# EAGLE design VIC20_HypExp (EAGLE 9.5.2)
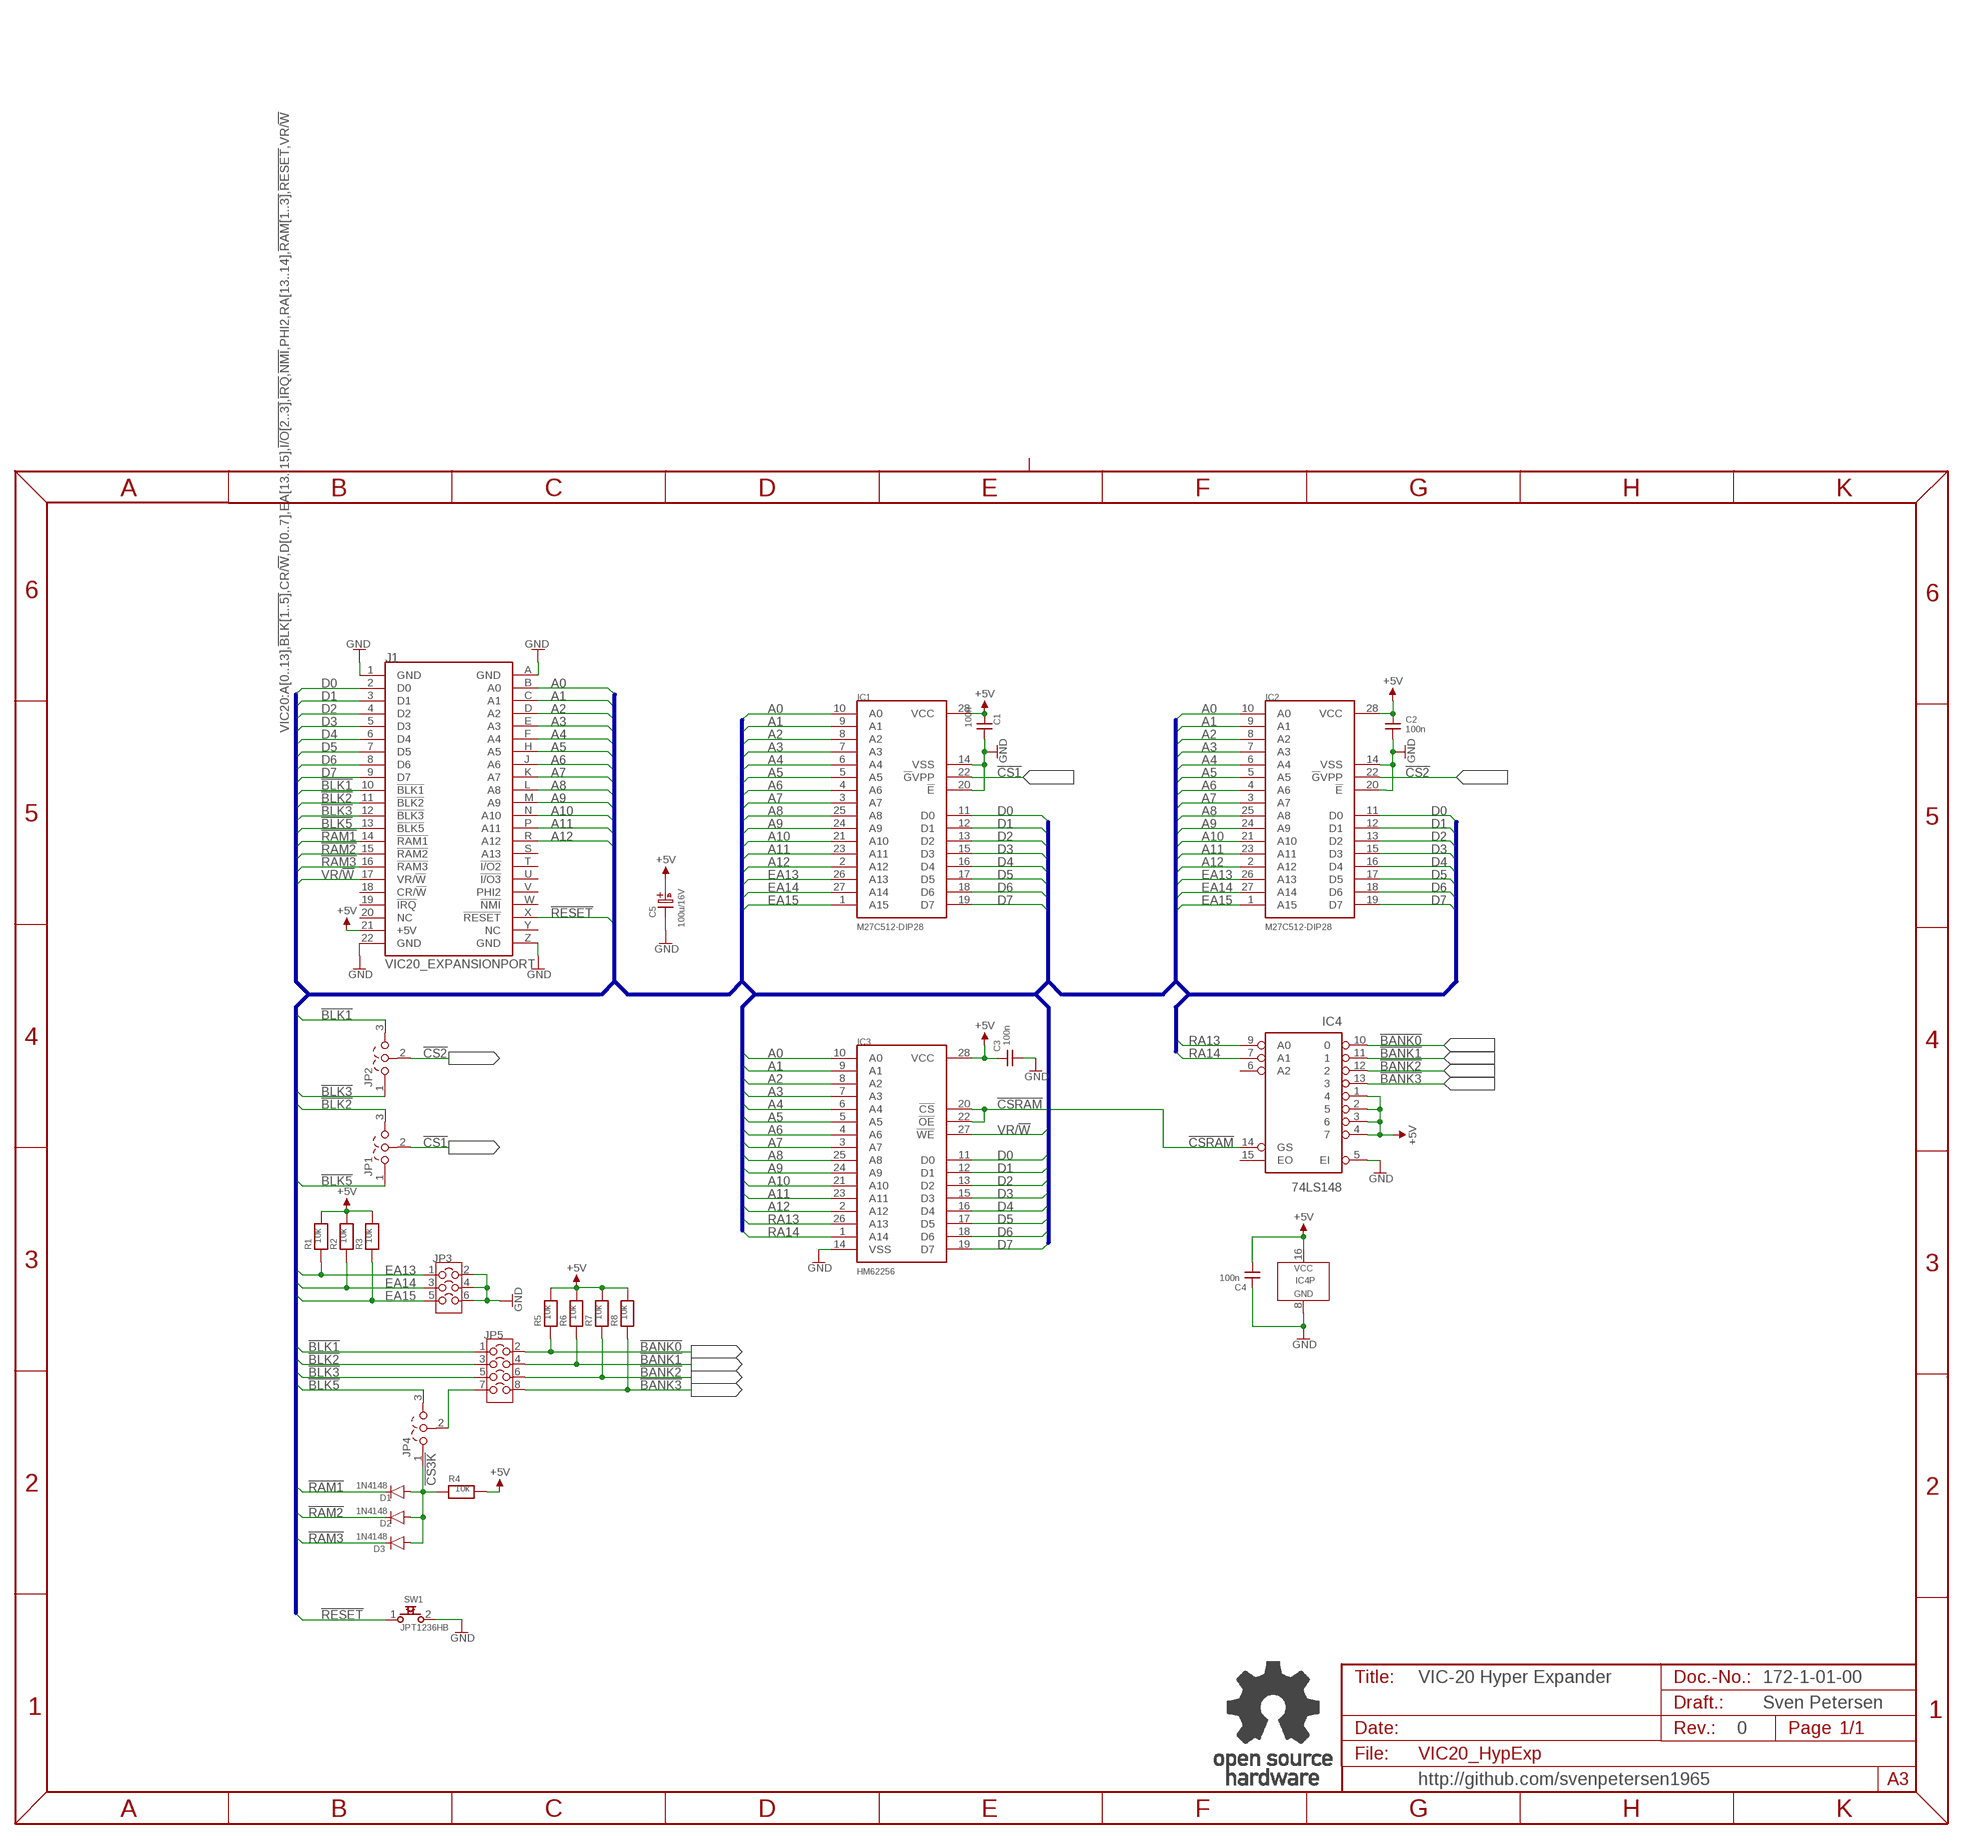
[diagram p0: schematic, sheet 1]

## Parts
C1  100n  CAP01  [C-2,5]
C2  100n  CAP01  [C-2,5]
C3  100n  CAP01  [C-2,5]
C4  100n  CAP01  [C-2,5]
C5  100u/16V  C07/2,5  [C07/2,5]
D1  1N4148  1N41480.3"  [DO-35/3]
D2  1N4148  1N41480.3"  [DO-35/3]
D3  1N4148  1N41480.3"  [DO-35/3]
IC1  M27C512-DIP28  [DIL28-6]
IC2  M27C512-DIP28  [DIL28-6]
IC3  HM62256  [DIL28-6]
IC4  74LS148  74148DIL  [DIL-16]
J1  VIC20_EXPANSIONPORT  [VIC20_EXPANSION]
JP1  COMBI-3P  [COMBI-3P]
JP2  COMBI-3P  [COMBI-3P]
JP3  COMBI-3X2P  [COMBI-3X2]
JP4  COMBI-3P  [COMBI-3P]
JP5  COMBI-4X2P  [COMBI-4X2]
R1  10k  RES04  [R-10]
R2  10k  RES04  [R-10]
R3  10k  RES04  [R-10]
R4  10k  RES04  [R-10]
R5  10k  RES04  [R-10]
R6  10k  RES04  [R-10]
R7  10k  RES04  [R-10]
R8  10k  RES04  [R-10]
SW1  JPT1236HB  [JTP_1236HB]
U$2  OPEN_SOURCE_HW  [OPENHW]

## Nets
!BANK0: IC4.10 JP5.2 R5.1
!BANK1: IC4.11 JP5.4 R6.1
!BANK2: IC4.12 JP5.6 R7.1
!BANK3: IC4.13 JP5.8 R8.1
!BLK1: J1.10(!BLK1) JP2.3 JP5.1
!BLK2: J1.11(!BLK2) JP1.3 JP5.3
!BLK3: J1.12(!BLK3) JP2.1 JP5.5
!BLK5: J1.13(!BLK5) JP1.1 JP4.3
!CS1: IC1.22(!G!VPP) JP1.2
!CS2: IC2.22(!G!VPP) JP2.2
!CS3K: D1.A D2.A D3.A JP4.1 R4.1
!CSRAM: IC3.20(!CS) IC3.22(!OE) IC4.14(GS)
!RAM1: D1.K J1.14(!RAM1)
!RAM2: D2.K J1.15(!RAM2)
!RAM3: D3.K J1.16(!RAM3)
!RESET: J1.X(!RESET) SW1.1
+5V: C1.1 C2.1 C3.2 C4.1 C5.A(+) IC1.28(VCC) IC2.28(VCC) IC3.28(VCC) IC4.1 IC4.2 IC4.3 IC4.4 IC4.16(VCC) J1.21(+5V) R1.2 R2.2 R3.2 R4.2 R5.2 R6.2 R7.2 R8.2
A0: IC1.10(A0) IC2.10(A0) IC3.10(A0) J1.B(A0)
A1: IC1.9(A1) IC2.9(A1) IC3.9(A1) J1.C(A1)
A2: IC1.8(A2) IC2.8(A2) IC3.8(A2) J1.D(A2)
A3: IC1.7(A3) IC2.7(A3) IC3.7(A3) J1.E(A3)
A4: IC1.6(A4) IC2.6(A4) IC3.6(A4) J1.F(A4)
A5: IC1.5(A5) IC2.5(A5) IC3.5(A5) J1.H(A5)
A6: IC1.4(A6) IC2.4(A6) IC3.4(A6) J1.J(A6)
A7: IC1.3(A7) IC2.3(A7) IC3.3(A7) J1.K(A7)
A8: IC1.25(A8) IC2.25(A8) IC3.25(A8) J1.L(A8)
A9: IC1.24(A9) IC2.24(A9) IC3.24(A9) J1.M(A9)
A10: IC1.21(A10) IC2.21(A10) IC3.21(A10) J1.N(A10)
A11: IC1.23(A11) IC2.23(A11) IC3.23(A11) J1.P(A11)
A12: IC1.2(A12) IC2.2(A12) IC3.2(A12) J1.R(A12)
D0: IC1.11(D0) IC2.11(D0) IC3.11(D0) J1.2(D0)
D1: IC1.12(D1) IC2.12(D1) IC3.12(D1) J1.3(D1)
D2: IC1.13(D2) IC2.13(D2) IC3.13(D2) J1.4(D2)
D3: IC1.15(D3) IC2.15(D3) IC3.15(D3) J1.5(D3)
D4: IC1.16(D4) IC2.16(D4) IC3.16(D4) J1.6(D4)
D5: IC1.17(D5) IC2.17(D5) IC3.17(D5) J1.7(D5)
D6: IC1.18(D6) IC2.18(D6) IC3.18(D6) J1.8(D6)
D7: IC1.19(D7) IC2.19(D7) IC3.19(D7) J1.9(D7)
EA13: IC1.26(A13) IC2.26(A13) JP3.1 R1.1
EA14: IC1.27(A14) IC2.27(A14) JP3.3 R2.1
EA15: IC1.1(A15) IC2.1(A15) JP3.5 R3.1
GND: C1.2 C2.2 C3.1 C4.2 C5.K(-) IC1.14(VSS) IC1.20(!E) IC2.14(VSS) IC2.20(!E) IC3.14(VSS) IC4.5(EI) IC4.8(GND) J1.1(GND) J1.22(GND) J1.A(GND) J1.Z(GND) JP3.2 JP3.4 JP3.6 SW1.2
N$1: JP4.2 JP5.7
RA13: IC3.26(A13) IC4.9(A0)
RA14: IC3.1(A14) IC4.7(A1)
VR/!W: IC3.27(!WE) J1.17(VR/!W)
Unconnected: IC4.6(A2) IC4.15(EO) J1.18(CR/!W) J1.19(!IRQ) J1.S(A13) J1.T(!I/O2) J1.U(!I/O3) J1.V(PHI2) J1.W(!NMI) J1.Y(NC)

## Buses
VIC20:A[0..13],!BLK[1..5],CR/!W,D[0..7],EA[13..15],!I/O[2..3],!IRQ,!NMI,PHI2,RA[13..14],!RAM[1..3],!RESET,VR/!W

## Notes on the sheet
- VIC-20 Hyper Expander | 172-1-01-00
- Sven Petersen
- 0
- http://github.com/svenpetersen1965

## Power pins joined to a net without a drawn wire
NC: J1.20(NC)

## Library data of the parts
C1-C4 = DISCRETE:CAP01
C5 = ELCO:C07/2,5
D1-D3 = Dioden:1N4148
IC1 IC2 = ST:M27C512
IC3 = Hitachi:HM62256
IC4 = 74XX:74148
J1 = Commodore:VIC20_EXPANSIONPORT
JP1 JP2 JP4 = Cutpad:COMBI-3P
JP3 = Cutpad:COMBI-3X2P
JP5 = Cutpad:COMBI-4X2P
R1-R8 = DISCRETE:RES04
SW1 = Namae_Electronics:JPT1236HB
U$2 = Logo:OPEN_SOURCE_HW

## Board
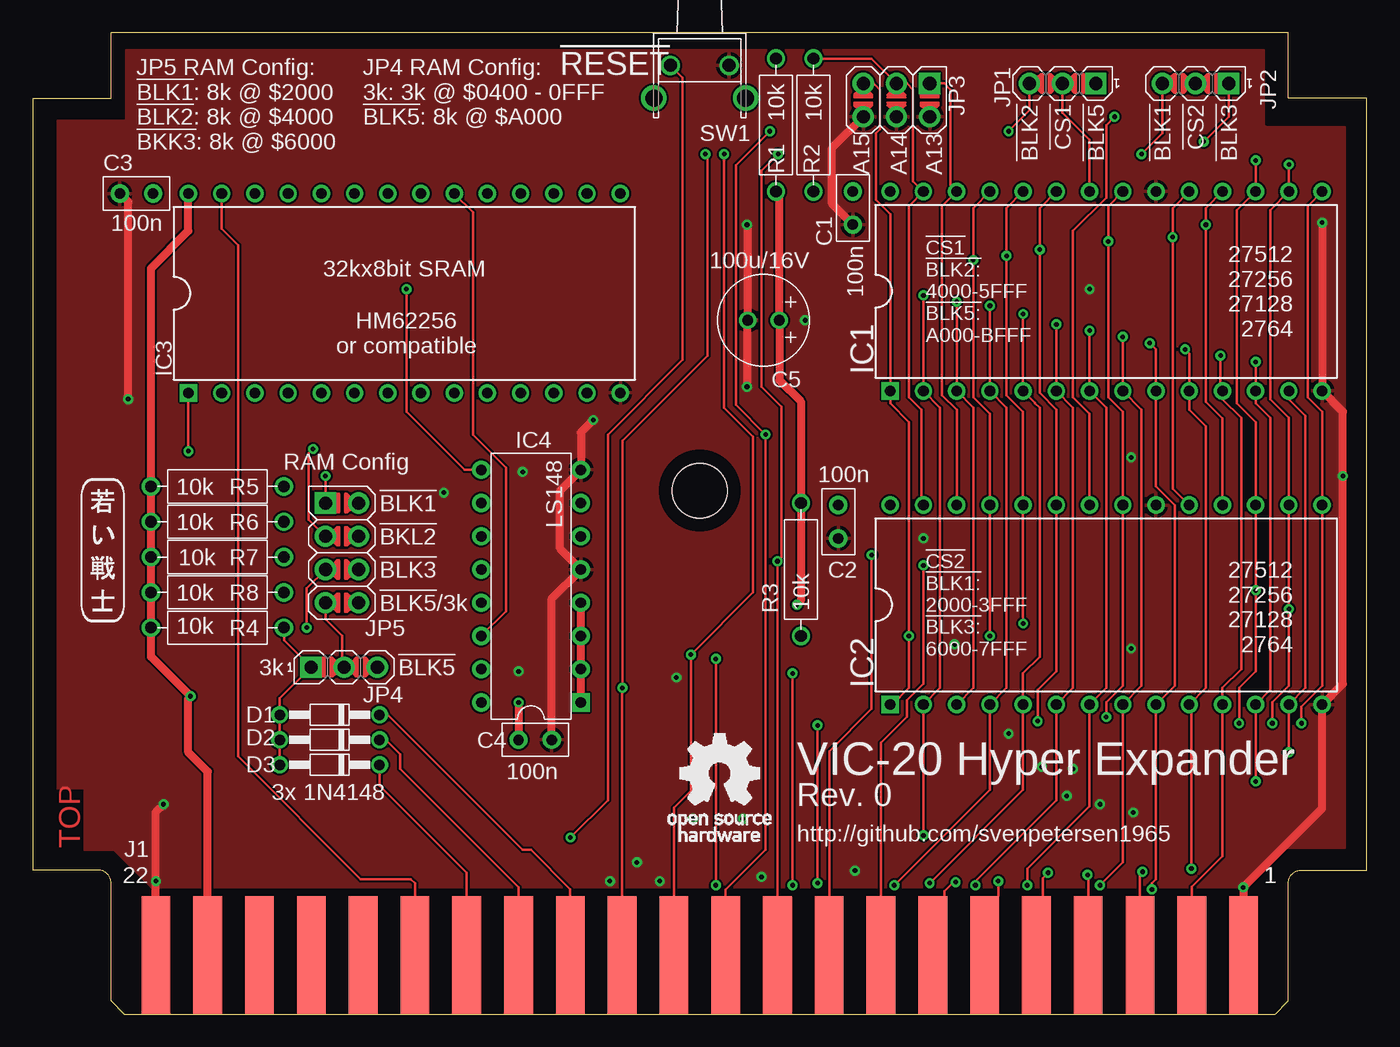
[diagram p1: board, top side]
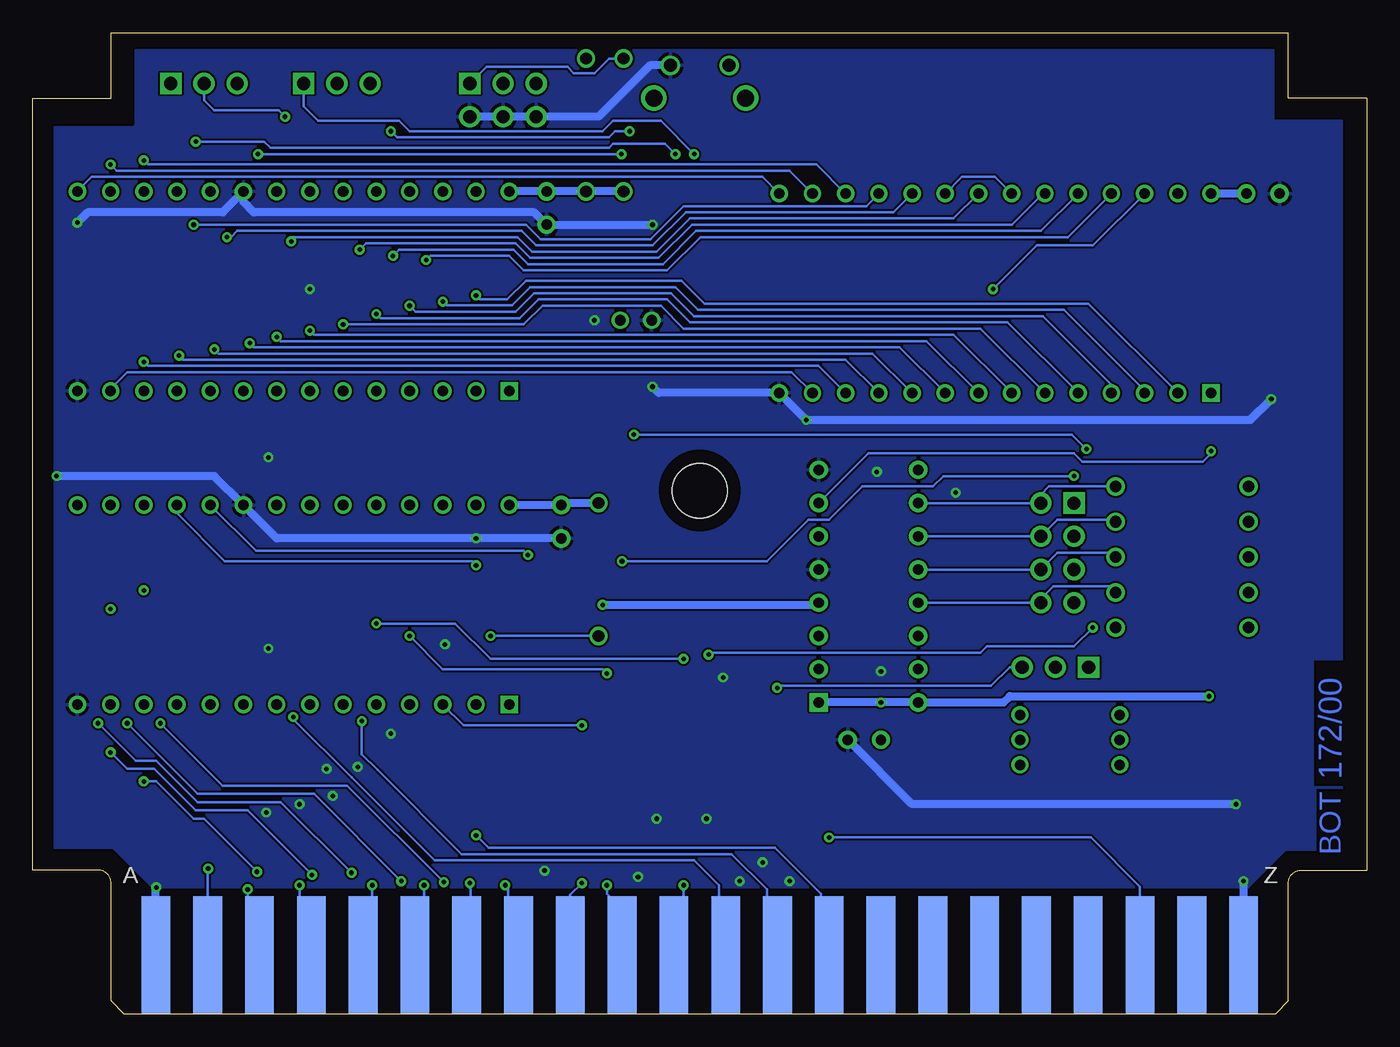
[diagram p2: board, bottom side, seen from below]

Size 102 x 75 mm. Coordinates in mm from the lower left corner, seen from the top.
Outline: 102,11 102,70 96,70 96,75 6,75 6,70 0,70 0,11
Copper layers (1*16): Top 0.035mm / dielectric 1.5mm / Bottom 0.035mm
Design rules "default *": minimum track width 6mil, minimum drill 0.35mm, track to track 6mil, track to pad 6mil, pad to pad 6mil, via to via 6mil, smd to smd 6mil, copper to edge 40mil, drill to drill 6mil, minimum pad ring 10mil, minimum via ring 8mil, stop-mask expansion 4mil, vias tented up to drill 23mil, thermal gap 10mil
Holes 4.2 mm at 51,40
bRestrict: 3 lines

### Footprints (pad centres in the part's own frame; a part is rotated, then mirrored left to right if it is on the bottom)
C-2,5 = drill 0.8 pad 1.397: 1 -1.27,0; 2 1.27,0
C07/2,5 = drill 0.813 pad 1.27: A -1.202,0; K 1.202,0
DO-35/3 = drill 0.8: A -3.81,0; K 3.81,0
DIL28-6 = drill 0.813 square: 1 -16.51,-7.62 | drill 0.813: 2 -13.97,-7.62; 3 -11.43,-7.62; 4 -8.89,-7.62; 5 -6.35,-7.62; 6 -3.81,-7.62; 7 -1.27,-7.62; 8 1.27,-7.62; 9 3.81,-7.62; 10 6.35,-7.62; 11 8.89,-7.62; 12 11.43,-7.62; 13 13.97,-7.62; 14 16.51,-7.62; 15 16.51,7.62; 16 13.97,7.62; 17 11.43,7.62; 18 8.89,7.62; 19 6.35,7.62; 20 3.81,7.62; 21 1.27,7.62; 22 -1.27,7.62; 23 -3.81,7.62; 24 -6.35,7.62; 25 -8.89,7.62; 26 -11.43,7.62; 27 -13.97,7.62; 28 -16.51,7.62
DIL-16 = drill 0.8 pad 1.397 square: 1 -8.89,-3.81 | drill 0.8 pad 1.397: 2 -6.35,-3.81; 3 -3.81,-3.81; 4 -1.27,-3.81; 5 1.27,-3.81; 6 3.81,-3.81; 7 6.35,-3.81; 8 8.89,-3.81; 9 8.89,3.81; 10 6.35,3.81; 11 3.81,3.81; 12 1.27,3.81; 13 -1.27,3.81; 14 -3.81,3.81; 15 -6.35,3.81; 16 -8.89,3.81
VIC20_EXPANSION = smd 2.2 x 9: 1 41.58,4.5; 2 37.62,4.5; 3 33.66,4.5; 4 29.7,4.5; 5 25.74,4.5; 6 21.78,4.5; 7 17.82,4.5; 8 13.86,4.5; 9 9.9,4.5; 10 5.94,4.5; 11 1.98,4.5; 12 -1.98,4.5; 13 -5.94,4.5; 14 -9.9,4.5; 15 -13.86,4.5; 16 -17.82,4.5; 17 -21.78,4.5; 18 -25.74,4.5; 19 -29.7,4.5; 20 -33.66,4.5; 21 -37.62,4.5; 22 -41.58,4.5 | smd 2.2 x 9 bottom: A 41.58,4.5; B 37.62,4.5; C 33.66,4.5; D 29.7,4.5; E 25.74,4.5; F 21.78,4.5; H 17.82,4.5; J 13.86,4.5; K 9.9,4.5; L 5.94,4.5; M 1.98,4.5; N -1.98,4.5; P -5.94,4.5; R -9.9,4.5; S -13.86,4.5; T -17.82,4.5; U -21.78,4.5; V -25.74,4.5; W -29.7,4.5; X -33.66,4.5; Y -37.62,4.5; Z -41.58,4.5
COMBI-3P = drill 1 pad 1.626 square: 1 -2.54,0 | drill 1 pad 1.626: 2 0,0; 3 2.54,0
COMBI-3X2 = drill 1 pad 1.626 square: 1 -1.27,2.54 | drill 1 pad 1.626: 2 1.27,2.54; 3 -1.27,0; 4 1.27,0; 5 -1.27,-2.54; 6 1.27,-2.54
COMBI-4X2 = drill 1 pad 1.626 square: 1 -1.27,3.81 | drill 1 pad 1.626: 2 1.27,3.81; 3 -1.27,1.27; 4 1.27,1.27; 5 -1.27,-1.27; 6 1.27,-1.27; 7 -1.27,-3.81; 8 1.27,-3.81
R-10 = drill 0.889 pad 1.397: 1 -5.08,0; 2 5.08,0
JTP_1236HB = drill 1: 1 2.25,0; 2 -2.25,0 | drill 1.3: CS1 3.5,2.5; CS2 -3.5,2.5

### Placement (x,y rotation side)
C1  62.71,61.59 270 top
C2  61.59,37.62 270 top
C3  7.94,62.71 0 top
C4  38.42,20.95 0 top
C5  55.88,53.02 180 top
D1  22.7,22.86 0 top
D2  22.7,20.95 0 top
D3  22.7,19.05 0 top
IC1  82.07,55.24 0 top
IC2  82.07,31.27 0 top
IC3  28.42,55.09 0 top
IC4  38.1,32.7 90 top
J1  51,0 0 top
JP1  78.74,71.12 180 top
JP2  88.9,71.12 180 top
JP3  66.04,69.85 270 top
JP4  23.81,26.51 0 top
JP5  23.65,35.24 0 top
R1  56.83,67.94 270 top
R2  59.69,67.94 270 top
R3  58.74,33.97 90 top
R4  14.13,29.53 180 top
R5  14.13,40.32 180 top
R6  14.13,37.62 180 top
R7  14.13,34.92 180 top
R8  14.13,32.23 180 top
SW1  51,72.5 180 top
U$2  48.58,13.18 0 top
U$15  [SVEN_TAG]  5.4,35.56 0 top
U$16  [2LAYER]  3.65,12.7 90 top
U$40  [PCB-TITLE/]  0,87 0 top  (outside the outline)

### Tracks (layer width: path | path; a pad name or v marks a point on that pad's centre or on a via)
!BANK0
  Bottom 0.203: IC4.10 JP5.2 24.92,39.69 24.29,40.32 R5.1
!BANK1
  Bottom 0.203: IC4.11 JP5.4 23.65,37.78 19.37,37.78 R6.1
!BANK2
  Bottom 0.203: IC4.12 JP5.6 23.65,35.24 19.53,35.24 R7.1
!BANK3
  Bottom 0.203: IC4.13 JP5.8 24.92,31.75 23.97,32.7 19.68,32.7 R8.1
!BLK1  (via drill 0.35)
  Top 0.203: J1.10 v56.94,34.61 57.26,34.92 57.26,46.41 55.72,47.94 55.72,64.45 v56.99,65.72 | v84.77,65.72 86.36,67.31 JP2.3 | JP5.1 v22.38,41.12
  Bottom 0.203: v56.99,65.72 v84.77,65.72 | v22.38,41.12 32.38,41.12 33.18,40.32 38.58,40.32 41.12,37.78 42.7,37.78 45.88,34.61 v56.94,34.61
!BLK2  (via drill 0.35)
  Top 0.203: J1.11 52.98,9.48 56.04,12.54 v56.04,44.29 53.76,46.57 53.76,64.88 v56.36,67.47 | v74.61,67.47 76.2,69.06 JP1.3 | JP5.3 21.11,37.78 21.11,42.86 v21.43,43.18
  Bottom 0.203: v56.36,67.47 57.47,67.47 57.94,66.99 74.14,66.99 v74.61,67.47 | v21.43,43.18 22.54,44.29 v56.04,44.29
!BLK3  (via drill 0.35)
  Top 0.203: J1.12 49.02,15.75 50.32,17.05 v50.32,27.46 55.09,32.23 55.09,44.13 52.86,46.35 v52.86,65.72 | v89.53,66.67 91.44,68.58 JP2.1 | JP5.5 20.95,32.54 v20.95,29.53
  Bottom 0.203: v52.86,65.72 53.66,66.52 57.63,66.52 57.94,66.2 83.82,66.2 84.3,66.67 v89.53,66.67 | v20.95,29.53 22.38,28.1 29.05,28.1 29.53,27.62 50.16,27.62 v50.32,27.46
!BLK5  (via drill 0.35)
  Top 0.203: v51.44,65.72 51.59,65.56 51.59,50.32 45.09,43.81 v45.09,24.92 45.06,24.9 J1.13
  Bottom 0.203: v51.44,65.72 53.98,68.26 57.63,68.26 58.42,67.47 73.18,67.47 73.98,68.26 80.17,68.26 81.28,69.37 JP1.1 | v45.09,24.92 44.93,25.08 28.73,25.08 27.3,26.51 JP4.3
!CS1
  Top 0.203: IC1.22 80.8,66.83 78.74,68.9 JP1.2
!CS2  (via drill 0.35)
  Top 0.203: IC2.22 80.8,45.88 79.53,47.15 79.53,59.85 82.07,62.39 82.07,67.94 v82.71,68.58
  Bottom 0.203: v82.71,68.58 83.19,69.06 88.11,69.06 88.9,69.85 JP2.2
!CS3K
  Top 0.203: D3.A D2.A D1.A 18.89,24.13 JP4.1 19.21,28.57 R4.1
!CSRAM
  Top 0.203: IC4.14 36.2,30.8 36.2,41.75 33.66,44.29 33.66,61.28 IC3.20
  Bottom 0.203: IC3.20 30.96,63.98 28.42,63.98 IC3.22
!RAM1
  Top 0.203: J1.14 41.1,9.54 38.1,12.54 37.47,12.54 27.15,22.86 D1.K
!RAM2
  Top 0.203: J1.15 37.14,9.69 28.1,18.73 28.1,19.84 26.99,20.95 D2.K
!RAM3
  Top 0.203: J1.16 33.18,10.79 26.51,17.46 D3.K
!RESET  (via drill 0.35)
  Top 0.203: v41.12,13.49 43.97,16.35 43.97,44.29 49.69,50.01 49.69,71.56 SW1.1
  Bottom 0.203: J1.X 17.34,9.72 21.11,13.49 v41.12,13.49
+5V  (via drill 0.35)
  Top 0.61: R1.2 57.08,62.62 C5.A 57.08,48.42 57.15,48.42 58.74,46.83 R3.2 58.74,31.59 v58.42,31.27 | v37.15,23.81 C4.1 | IC4.1 IC4.2 IC4.3 IC4.4 | J1.21 13.38,18.53 11.91,20 11.91,24.13 v12.06,24.29 9.05,27.3 R4.2 R8.2 R7.2 R6.2 R5.2 9.05,56.99 11.91,59.85 IC3.28
  Bottom 0.61: R1.2 R2.2 C1.1 IC1.28 | R3.2 61.44,39.05 C2.1 IC2.28 | IC4.1 v37.15,23.81 IC4.16 27.78,23.81 27.3,24.29 v12.06,24.29 | v58.42,31.27 42.07,31.27 IC4.4 | C3.2 IC3.28
A0  (via drill 0.35)
  Top 0.203: v88.11,50.8 88.42,50.48 IC1.10 88.42,46.2 89.69,44.93 89.69,24.92 IC2.10 88.58,23.5 v88.58,11.11
  Bottom 0.203: J1.B 88.62,11.07 v88.58,11.11 | v88.11,50.8 87.79,50.48 37.78,50.48 IC3.10
A1  (via drill 0.35)
  Top 0.203: v85.41,51.28 85.88,50.8 85.88,50.01 IC1.9 85.88,40.32 87.31,38.89 87.31,25.08 IC2.9 85.88,10.32 85.57,10 v85.57,9.53
  Bottom 0.203: v85.57,9.53 85.57,5.41 J1.C | v85.41,51.28 85.09,50.96 35.72,50.96 IC3.9
A2  (via drill 0.35)
  Top 0.203: v83.34,51.75 IC1.8 84.77,46.2 84.77,25.08 IC2.8 83.34,11.59 v81.6,9.84
  Bottom 0.203: v81.6,9.84 81.6,5.4 J1.D | v83.34,51.75 83.03,51.44 33.66,51.44 IC3.8
A3  (via drill 0.35)
  Top 0.203: v80.8,52.23 IC1.7 82.07,46.35 82.07,24.92 IC2.7 80.8,15.88 76.04,11.11 v76.04,9.84
  Bottom 0.203: v76.04,9.84 76.04,5.2 J1.E | v80.8,52.23 80.49,51.91 31.59,51.91 IC3.7
A4  (via drill 0.35)
  Top 0.203: v78.26,52.7 IC1.6 79.53,46.35 79.53,24.92 IC2.6 78.26,16.35 72.07,10.16 v72.07,9.84
  Bottom 0.203: J1.F 72.07,5.21 v72.07,9.84 | v78.26,52.7 64.45,52.7 63.02,54.13 53.98,54.13 52.23,52.39 29.53,52.39 IC3.6
A5  (via drill 0.35)
  Top 0.203: v68.58,10 75.72,17.14 IC2.5 75.72,26.04 76.99,27.3 76.99,46.33 76.64,46.68 76.64,46.71 75.8,47.55 IC1.5 v75.72,53.5
  Bottom 0.203: J1.H 68.5,4.82 68.5,9.92 v68.58,10 | v75.72,53.5 75.41,53.18 64.77,53.18 63.34,54.61 53.5,54.61 51.75,52.86 27.46,52.86 IC3.5
A6  (via drill 0.35)
  Top 0.203: v65.88,9.84 73.18,17.14 IC2.4 74.45,24.92 74.45,46.35 IC1.4 v73.18,54.13
  Bottom 0.203: v65.88,9.84 65.65,9.62 65.65,5.29 J1.J | v73.18,54.13 72.71,53.66 65.09,53.66 63.66,55.09 53.18,55.09 51.44,53.34 24.77,53.34 19.53,48.1 IC3.4
A7  (via drill 0.35)
  Top 0.203: IC2.3 71.91,24.92 71.91,46.35 IC1.3 v70.64,54.45 | v60.01,10 v60.01,22.07
  Bottom 0.203: IC2.3 69.06,22.07 v60.01,22.07 | J1.K 60.9,9.11 v60.01,10 | v70.64,54.45 70.36,54.17 65.37,54.17 63.98,55.56 52.86,55.56 51.12,53.82 23.18,53.82 16.99,47.62 IC3.3
A8  (via drill 0.35)
  Top 0.203: IC1.25 71.91,61.59 v71.91,57.63 71.91,47.15 73.18,45.88 IC2.25 v73.18,28.89 | v58.1,9.84 v58.1,26.04
  Bottom 0.203: v73.18,28.89 70.64,26.35 58.42,26.35 v58.1,26.04 | J1.L 56.94,8.04 58.1,9.21 v58.1,9.84 | v71.91,57.63 71.6,57.94 65.56,57.94 64.45,56.83 53.5,56.83 50.96,59.37 22.86,59.37 IC3.25
A9  (via drill 0.35)
  Top 0.203: IC1.24 74.45,61.59 v74.45,57.94 74.45,47.31 75.72,46.04 IC2.24 v75.72,29.84 | v52.23,9.84 v52.23,27.15
  Bottom 0.203: v75.72,29.84 69.69,29.84 66.99,27.15 v52.23,27.15 | J1.M 52.23,5.25 v52.23,9.84 | v74.45,57.94 73.98,58.42 65.25,58.42 64.14,57.31 53.82,57.31 51.28,59.85 24.92,59.85 IC3.24
A10  (via drill 0.35)
  Top 0.203: IC1.21 82.23,61.75 v82.23,59.05 82.23,47.15 83.34,46.04 IC2.21 83.34,25.08 82.07,23.81 v82.07,22.7
  Bottom 0.203: J1.N 49.53,5.01 49.53,9.84 51.44,11.75 71.28,11.75 77.63,18.1 82.07,22.54 v82.07,22.7 | v82.23,59.05 82.07,59.21 82.07,59.37 64.93,59.37 63.82,58.26 54.29,58.26 51.75,60.8 31.59,60.8 IC3.21
A11  (via drill 0.35)
  Top 0.203: IC1.23 76.99,61.59 v76.99,58.42 76.99,47.47 78.26,46.2 IC2.23 78.26,26.19 76.83,24.77 v76.83,22.38
  Bottom 0.203: J1.P 45.88,5.32 45.88,9.53 48.58,12.22 69.22,12.22 75.64,18.65 76.83,19.84 v76.83,22.38 | v76.99,58.42 76.52,58.9 65.09,58.9 63.98,57.78 54.13,57.78 51.59,60.33 27.15,60.33 24.77,62.71 IC3.23
A12  (via drill 0.35)
  Top 0.203: v68.1,13.65 IC2.2 69.37,24.92 69.37,46.35 IC1.2 v68.1,54.93
  Bottom 0.203: J1.R 41.75,5.15 41.75,9.21 45.24,12.7 67.15,12.7 v68.1,13.65 | v68.1,54.93 67.79,54.61 65.72,54.61 64.29,56.04 52.39,56.04 50.64,54.29 21.27,54.29 IC3.2
D0  (via drill 0.35)
  Top 0.203: J1.2 88.62,9.72 90.96,12.06 IC2.11 90.96,24.92 92.39,26.35 92.39,45.56 90.96,46.99 IC1.11 90.81,47.78 v90.81,50.32
  Bottom 0.203: v90.81,50.32 90.49,50.01 39.85,50.01 IC3.11
D1  (via drill 0.35)
  Top 0.203: v93.5,49.85 IC1.12 93.5,46.67 94.61,45.56 94.61,24.77 IC2.12 v93.5,17.78 | J1.3 84.66,10.52 84.93,10.79 v84.85,10.87
  Bottom 0.203: v84.85,10.87 88.9,14.92 89.69,14.92 92.55,17.78 v93.5,17.78 | v93.5,49.85 93.19,49.53 41.91,49.53 IC3.12
D2  (via drill 0.35)
  Top 0.203: IC1.13 96.04,46.99 97.31,45.72 97.31,24.92 IC2.13 96.04,20.16 v96.04,20 | J1.4 80.7,10.58 v80.64,10.64
  Bottom 0.203: v80.64,10.64 85.57,15.56 89.53,15.56 92.71,18.73 94.77,18.73 v96.04,20 | IC3.13 43.97,49.05 94.77,49.05 96.04,47.78 IC1.13
D3  (via drill 0.35)
  Top 0.203: IC1.15 97.47,61.75 97.47,47.15 98.58,46.04 IC2.15 98.58,25.08 97,23.5 v97,22.23 | J1.5 77.22,4.98 77.22,10.38 v77.63,10.79
  Bottom 0.203: v77.63,10.79 83.03,16.19 89.38,16.19 92.55,19.37 94.14,19.37 v97,22.23 | IC1.15 97.47,63.98 46.2,63.98 IC3.15
D4  (via drill 0.35)
  Top 0.203: J1.6 72.78,8.01 73.82,9.05 v73.82,10.16 | v94.77,22.23 94.77,23.81 96.04,25.08 v96.04,30.96 IC2.16 96.04,45.56 94.61,46.99 94.61,61.44 IC1.16 v96.04,64.93
  Bottom 0.203: v73.82,10.16 80.49,16.83 89.38,16.83 v94.77,22.23 | v96.04,64.93 95.57,64.45 44.13,64.45 IC3.16
D5  (via drill 0.35)
  Top 0.203: J1.7 69.69,5.37 69.69,9.37 70.48,10.16 v70.56,10.08 | v92.23,22.23 92.23,24.92 93.5,26.19 v93.5,32.38 IC2.17 93.5,45.24 92.08,46.67 92.08,61.44 IC1.17 v93.5,65.25
  Bottom 0.203: v70.56,10.08 77.95,17.46 87.47,17.46 v92.23,22.23 | v93.5,65.25 93.19,64.93 42.07,64.93 IC3.17
D6  (via drill 0.35)
  Top 0.203: IC2.18 90.96,45.54 89.69,46.81 v89.69,60.33 89.69,61.59 IC1.18 | J1.8 64.86,20.73 66.83,22.7 66.83,23.97 68.1,25.24 v68.1,34.29
  Bottom 0.203: v68.1,34.29 68.42,34.61 87.31,34.61 90.96,38.26 IC2.18 | v89.69,60.33 82.23,60.33 64.29,60.33 63.18,59.21 54.77,59.21 52.23,61.75 38.26,61.75 IC3.18
D7  (via drill 0.35)
  Top 0.203: IC1.19 87.15,61.59 v87.15,59.37 87.15,40.16 IC2.19 | J1.9 60.9,20.1 64.14,23.34 v64.14,35.08
  Bottom 0.203: v64.14,35.08 64.45,35.4 84.93,35.4 IC2.19 | v87.15,59.37 86.84,59.37 86.36,59.85 64.61,59.85 63.5,58.74 54.61,58.74 52.07,61.28 36.2,61.28 IC3.19
EA13
  Top 0.203: IC2.26 70.64,46.2 69.53,47.31 69.53,61.75 IC1.26 70.17,63.34 70.17,70.64 69.69,71.12 JP3.1
  Bottom 0.203: R1.1 57.94,73.03 59.05,71.91 60.64,71.91 61.12,72.39 67.31,72.39 JP3.1
EA14
  Top 0.203: IC2.27 67.94,39.05 67.94,46.2 66.99,47.15 66.99,61.75 IC1.27 67.31,63.66 67.31,70.64 66.83,71.12 JP3.3 64.14,73.03 R2.1
EA15  (via drill 0.35)
  Top 0.203: IC2.1 65.72,23.65 66.99,24.92 v66.99,28.89 66.99,45.24 65.56,46.67 IC1.1 65.56,61.12 64.45,62.23 64.45,67.31 64.77,67.63 64.77,70.64 64.29,71.12 JP3.5
  Bottom 0.203: R3.1 v66.99,28.89
GND  (via drill 0.35)
  Top 0.61: C1.2 61.12,61.91 61.12,66.2 JP3.6 | v98.58,60.48 IC1.14 100.17,46.04 v100.17,41.12 100.17,25.24 IC2.14 98.58,15.72 v92.55,9.68 92.55,4.53 J1.A | v54.61,47.94 54.61,52.95 C5.K 54.68,60.26 v54.61,60.33 | J1.Z v9.42,10.16 9.42,15.45 v10,16.03 | C4.2 39.69,31.75 IC4.5 40.32,35.56 40.32,40.01 IC4.8 41.91,44.45 v42.86,45.4 | C3.1 7.3,62.07 v7.3,46.99
  Bottom 0.61: JP3.2 JP3.4 JP3.6 58.74,68.58 54.82,72.5 SW1.2 | v98.58,60.48 97.79,61.28 87.47,61.28 IC1.20 85.88,62.07 85.09,61.28 63.66,61.28 C1.2 v54.61,60.33 | v100.17,41.12 88.11,41.12 IC2.20 83.34,36.35 C2.2 | v54.61,47.94 54.13,47.47 IC3.14 v42.86,45.4 8.89,45.4 v7.3,46.99 | J1.A 92.58,9.65 v92.55,9.68 | J1.Z 9.42,10.05 9.53,10.16 v9.42,10.16 | C4.2 34.77,16.03 v10,16.03
  other vias: 62.87,10.95 46.2,11.59 84.14,15.4 81.6,16.03 79.06,16.67 70.48,28.26 49.21,25.72 74.61,21.43 77.15,18.89 44.13,10.16 47.94,10.16 79.53,18.73 68.1,36.35 83.98,42.55 83.98,27.94 50.48,14.92 54.29,14.92 80.8,55.4 55.72,10.48 37.15,26.19 37.47,41.43 31.43,39.85 59.05,53.02
  pour Top: 1.91,68.26 7.14,68.26 7.14,73.66 94.14,73.66 94.14,67.94 94.3,67.79 100.33,67.79 100.33,12.7 95.89,12.7 95.73,12.86 92.55,9.68 9.05,9.68 6.19,12.54 1.91,12.54
  pour Bottom: 1.91,68.26 7.14,68.26 7.14,73.66 94.14,73.66 94.14,67.94 94.3,67.79 100.33,67.79 100.33,12.7 95.89,12.7 92.87,9.68 91.6,9.68 9.05,9.68 6.19,12.54 1.91,12.54
N$1
  Top 0.203: JP4.2 23.65,26.67 23.65,28.89 22.38,30.16 JP5.7
RA13  (via drill 0.35)
  Top 0.203: IC4.9 33.02,41.59 28.57,46.04 v28.57,55.4
  Bottom 0.203: v28.57,55.4 25.24,58.74 20.95,58.74 IC3.26
RA14  (via drill 0.35)
  Top 0.203: v11.91,43.02 IC3.1
  Bottom 0.203: IC4.7 38.1,42.86 22.38,42.86 21.75,42.23 12.54,42.23 11.91,42.86 v11.91,43.02
VR/!W
  Top 0.203: IC3.27 14.45,60.01 15.72,58.74 15.72,19.68 25.08,10.32 28.89,10.32 29.22,9.99 J1.17

### Text on the board
Bottom: 172/00
tPlace: !RESET | 10k | 10k | !BLK2 | !CS1 | !BLK5 | !BLK1 | !CS2 | !BLK3 | JP4 RAM Config: / 3k: 3k @ $0400 - 0FFF / !BLK5!: 8k @ $A000 | JP5 RAM Config: / !BLK1!: 8k @ $2000 / !BLK2!: 8k @ $4000 / !BKK3!: 8k @ $6000 | A15 | A14 | A13 | 100n | 100n | 100u/16V | 32kx8bit SRAM | !CS1 / !BLK2: / 4000-5FFF / !BLK5: / A000-BFFF | 27512 / 27256 / 27128 / 2764 | HM62256 / or compatible | RAM Config | 100n | 10k | !BLK1 | 10k | !BKL2 | LS148 | 10k | !BLK3 | 10k | !BLK5!/3k | 10k | !CS2 / !BLK1: / 2000-3FFF / !BLK3: / 6000-7FFF | 27512 / 27256 / 27128 / 2764 | 10k | 3k | !BLK5 | 100n | VIC-20 Hyper Expander | 3x 1N4148 | Rev. 0 | http://github.com/svenpetersen1965
Document: 172-2-01-00 | Sven Petersen / 2020 | 35µm | 2 | 0